# EasyEDA Pro project tachyon.eprj, schematic io-board-schematic

## Sheets
1 IO: Board Name: io-board; Create Date: 2026-04-07; Page Name: IO; Project Name: tachyon; Schematic Name: tachyon-board-schematic; Update Date: 2026-04-30; Company: EasyEDA.com; Page Size: A4; Version: V1.0
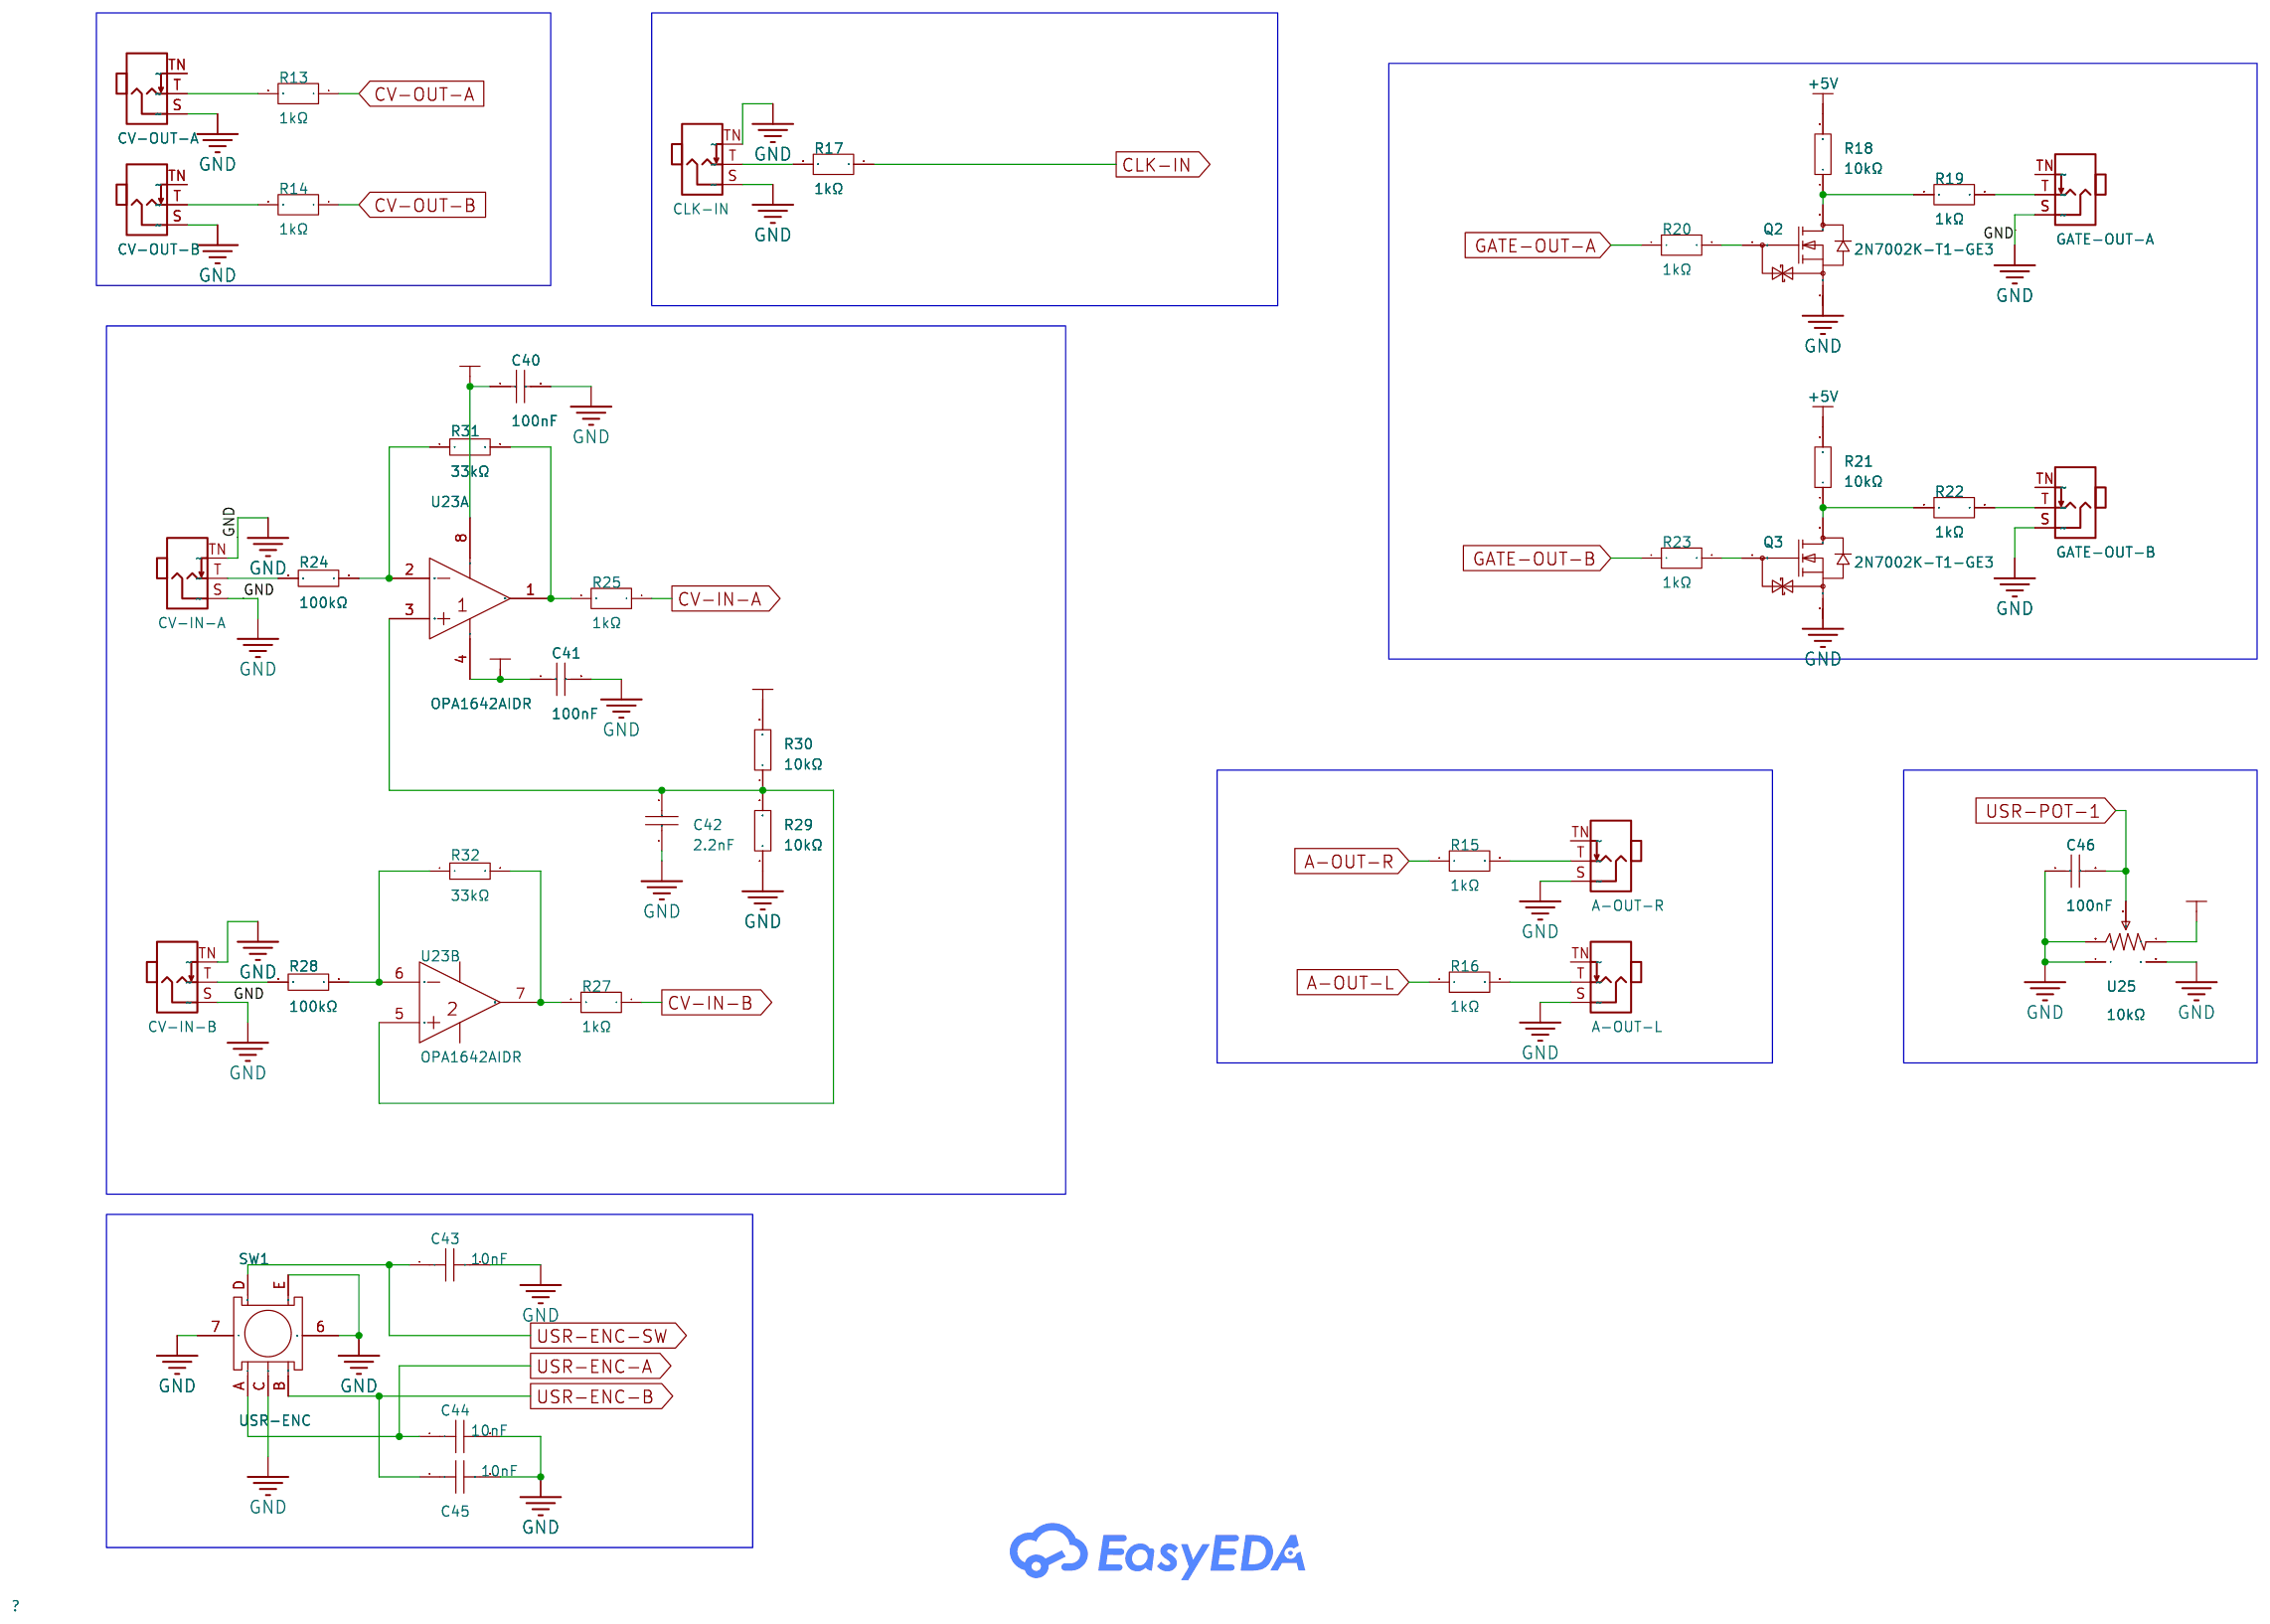
[diagram p0: IO]
2 Interconnect: Create Date: 2026-04-23; Page Name: Interconnect; Schematic Name: tachyon; Update Date: 2026-04-23
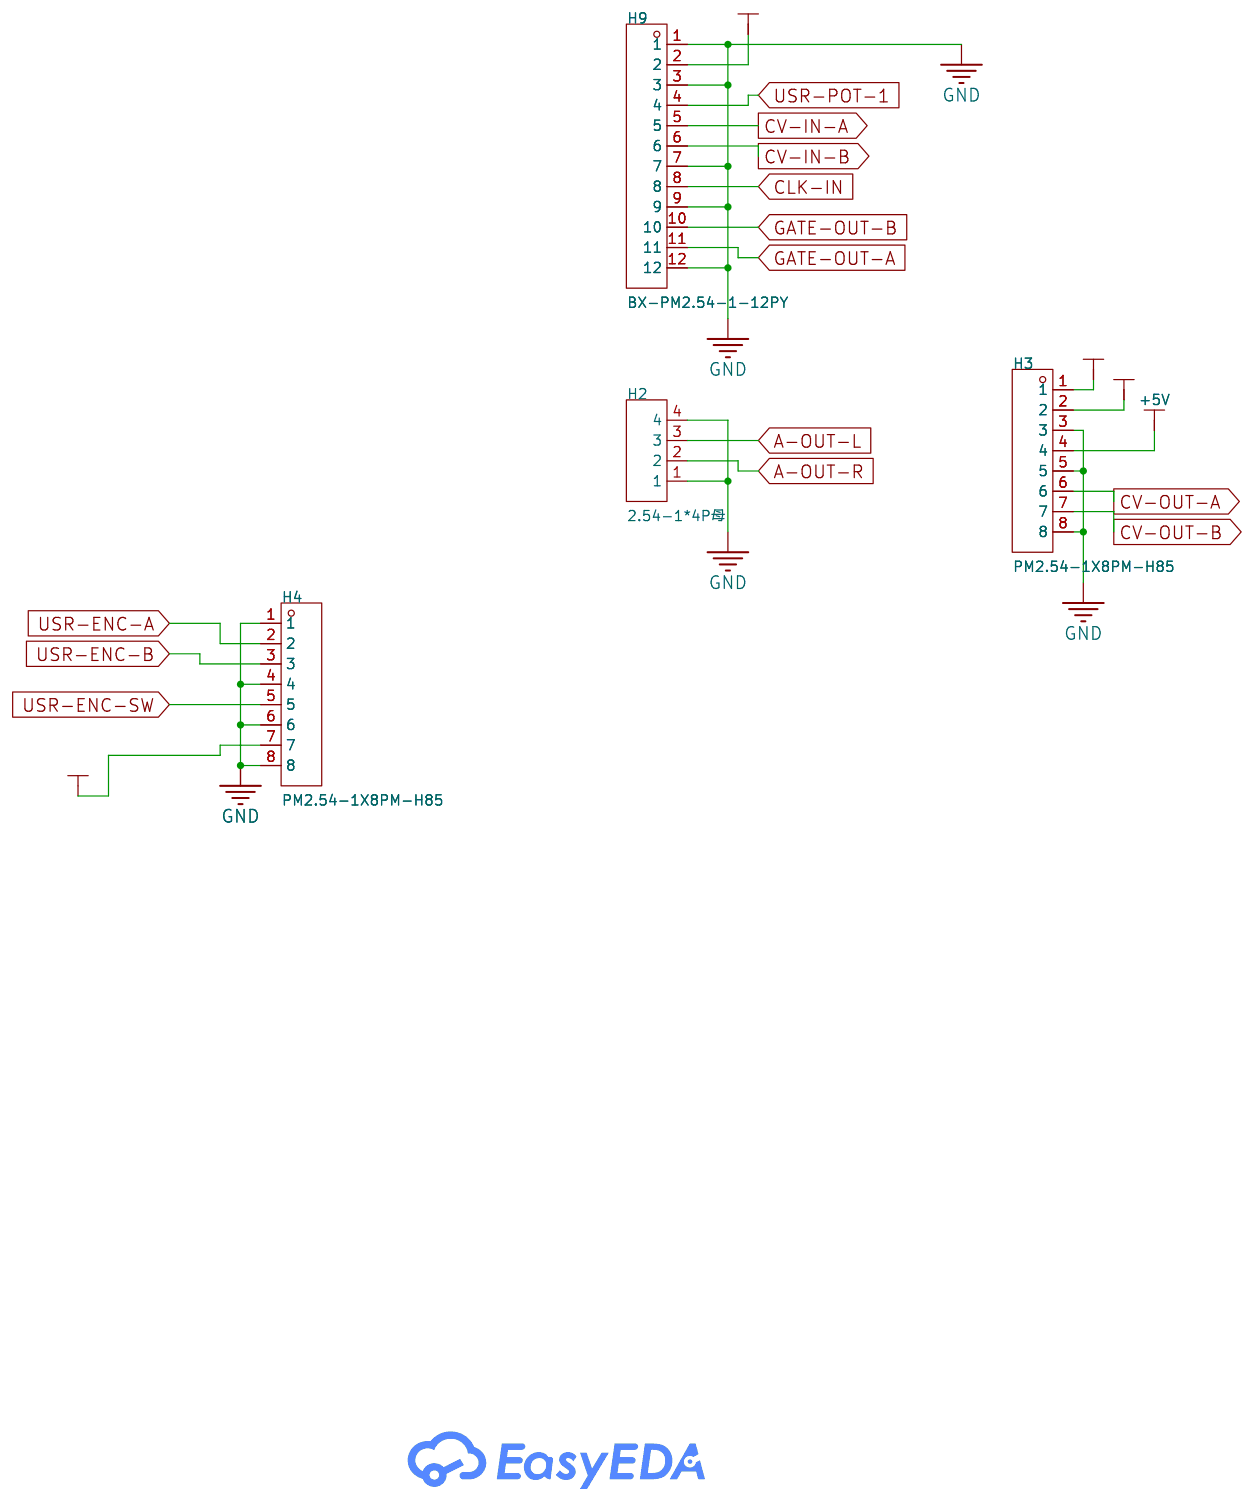
[diagram p1: Interconnect]

## Parts
sheet Interconnect
H2  2.54-1*4P母  [HDR-TH_4P-P2.54-V-F]
H3  PM2.54-1X8PM-H85  [HDR-TH_8P-P2.54-V-F]
H4  PM2.54-1X8PM-H85  [HDR-TH_8P-P2.54-V-F]
H9  BX-PM2.54-1-12PY  [HDR-TH_12P-P2.54-V-F]
sheet IO
C40  100nF  [C0805]
C41  100nF  [C0805]
C42  2.2nF  [C0805]
C43  10nF  [C0805]
C44  10nF  [C0805]
C45  10nF  [C0805]
C46  100nF  [C0805]
Q2  2N7002K-T1-GE3  [SOT-23-3_L2.9-W1.6-P1.90-LS2.8-BR]
Q3  2N7002K-T1-GE3  [SOT-23-3_L2.9-W1.6-P1.90-LS2.8-BR]
R13  1kΩ  [R0805]
R14  1kΩ  [R0805]
R15  1kΩ  [R0805]
R16  1kΩ  [R0805]
R17  1kΩ  [R0805]
R18  10kΩ  [R0805]
R19  1kΩ  [R0805]
R20  1kΩ  [R0805]
R21  10kΩ  [R0805]
R22  1kΩ  [R0805]
R23  1kΩ  [R0805]
R24  100kΩ  [R0805]
R25  1kΩ  [R0805]
R27  1kΩ  [R0805]
R28  100kΩ  [R0805]
R29  10kΩ  [R0805]
R30  10kΩ  [R0805]
R31  33kΩ  [R0805]
R32  33kΩ  [R0805]
SW1  USR-ENC  [SW-TH_EC11XXXXXXXX]
U8  CV-OUT-A  [Jack_3.5mm_QingPu_WQP-PJ301M-12_Vertical]
U9  CV-OUT-B  [Jack_3.5mm_QingPu_WQP-PJ301M-12_Vertical]
U17  A-OUT-R  [Jack_3.5mm_QingPu_WQP-PJ301M-12_Vertical]
U18  A-OUT-L  [Jack_3.5mm_QingPu_WQP-PJ301M-12_Vertical]
U19  CLK-IN  [Jack_3.5mm_QingPu_WQP-PJ301M-12_Vertical]
U20  GATE-OUT-A  [Jack_3.5mm_QingPu_WQP-PJ301M-12_Vertical]
U21  GATE-OUT-B  [Jack_3.5mm_QingPu_WQP-PJ301M-12_Vertical]
U22  CV-IN-A  [Jack_3.5mm_QingPu_WQP-PJ301M-12_Vertical]
U23  OPA1642AIDR  [SOIC-8_L4.9-W3.9-P1.27-LS6.0-BL]  (sections 1,2)
U24  CV-IN-B  [Jack_3.5mm_QingPu_WQP-PJ301M-12_Vertical]
U25  10kΩ  [RES-ADJ-TH_RK09L1140A65]

## Library data of the parts
H2 = 2.54-1*4P母: LCSC Part Name: 间距:2.54mm 1x4P 直插; Supplier Part: C2718488; Manufacturer: BOOMELE(博穆精密); Supplier Footprint: 插件,P=2.54mm; JLCPCB Part Class: Extended Part; Datasheet: https://item.szlcsc.com/datasheet/2.54-1*4P%25E6%25AF%258D/2834502.html; Supplier: LCSC; Holes Structure: 1x4P; Pitch: 2.54mm; Circular Hole / Square Hole: Square Hole; Mounting Type: Through Hole; Number of Rows: 1; Number of Positions: 4P; Current Rating: 3A; Holes Direction: Top; Contact Material: Bronze; Operating Temperature: -40℃~+105℃
H3 H4 = PM2.54-1X8PM-H85: LCSC Part Name: 1x8P 间距:2.54mm 直插; Supplier Part: C42431840; Manufacturer: JXTCONN(聚兴泰); Supplier Footprint: 插件,P=2.54mm; JLCPCB Part Class: Extended Part; Datasheet: https://item.szlcsc.com/datasheet/PM2.54-1X8PM-H85/44458970.html; Supplier: LCSC; Holes Structure: 1x8P; Pitch: 2.54mm; Circular Hole / Square Hole: Square Hole; Mounting Type: Through Hole; Number of Rows: 1; Number of Positions: 8P; Current Rating: 3A; Holes Direction: Top; Insulation Height: 8.5mm; Contact Plating: Gold; Operating Temperature: -40℃~+105℃
H9 = BX-PM2.54-1-12PY: LCSC Part Name: 1x12P 间距:2.54mm 直插; Supplier Part: C18078134; Manufacturer: Bossie(博锡); Supplier Footprint: 插件,P=2.54mm; JLCPCB Part Class: Extended Part; Datasheet: https://item.szlcsc.com/datasheet/BX-PM2.54-1-12PY/19218535.html; Supplier: LCSC; Holes Structure: 1x12P; Pitch: 2.54mm; Circular Hole / Square Hole: Square Hole; Mounting Type: Through Hole; Number of Rows: 1; Number of Positions: 12P; Current Rating: 3A; Holes Direction: Top; Insulation Height: 8.5mm; Contact Material: Brass; Contact Plating: Gold; Operating Temperature: -40℃~+105℃; PIN Length: 3.2mm
C40 C41 C46 = CL21B104KBCNNNC: Capacitance:100nF Tolerance:±10% Tolerance:±10% Voltage Rating:50V Temperature Coefficient:X7R; LCSC Part Name: 100nF ±10% 50V; Supplier Part: C1711; Manufacturer: SAMSUNG(三星); Supplier Footprint: 0805; JLCPCB Part Class: Extended Part; Datasheet: https://item.szlcsc.com/datasheet/CL21B104KBCNNNC/2063.html; Supplier: LCSC; Tolerance: ±10%; Voltage Rating: 50V; Temperature Coefficient: X7R
C42 = CC0805JKNPO9BN222: LCSC Part Name: 2.2nF ±5% 50V; Supplier Part: C107103; Manufacturer: YAGEO(国巨); Supplier Footprint: 0805; JLCPCB Part Class: Extended Part; Datasheet: https://item.szlcsc.com/datasheet/CC0805JKNPO9BN222/108319.html; Supplier: LCSC; Tolerance: ±5%; Voltage Rating: 50V; Temperature Coefficient: NP0
C43-C45 = CC0805KRX7R9BB103: LCSC Part Name: 10nF ±10% 50V; Supplier Part: C83170; Manufacturer: YAGEO(国巨); Supplier Footprint: 0805; JLCPCB Part Class: Extended Part; Datasheet: https://item.szlcsc.com/datasheet/CC0805KRX7R9BB103/84334.html; Supplier: LCSC; Tolerance: ±10%; Voltage Rating: 50V; Temperature Coefficient: X7R
Q2 Q3 = 2N7002K-T1-GE3: LCSC Part Name: 1个N沟道 耐压:60V 电流:300mA; Supplier Part: C81445; Manufacturer: VISHAY(威世); Supplier Footprint: SOT-23; JLCPCB Part Class: Extended Part; Datasheet: https://item.szlcsc.com/datasheet/2N7002K-T1-GE3/82596.html; Supplier: LCSC; Number: One N-channel; Drain to Source Voltage: 60V; Current - Continuous Drain(Id): 300mA; RDS(on): 2Ω@10V,500mA; Pd - Power Dissipation: 350mW; Gate Threshold Voltage (Vgs(th)): 2.5V; Gate Charge(Qg): 600pC@10V; Reverse Transfer Capacitance (Crss@Vds): 2.5pF@10V; Operating Temperature: -55℃~+150℃
R13-R17 R19 R20 R22 R23 R25 R27 = AC0805FR-7W1KL: Type:Thick Film Resistors Resistance: Tolerance:±1% Tolerance:±1% Power(Watts):250mW Overload Voltage (Max): Temperature Coefficient:±100ppm/℃ Temperature Coefficient:±100ppm/℃ Operating Temperature Range:-55℃~+155℃ Operating Temperature Range:-55℃~+155℃; LCSC Part Name: 厚膜电阻 1kΩ ±1% 250mW; Supplier Part: C727989; Manufacturer: YAGEO(国巨); Supplier Footprint: 0805; JLCPCB Part Class: Extended Part; Datasheet: https://atta.szlcsc.com/upload/public/pdf/source/20200821/C727952_41DBFD40DC9019BCD03635260E40DDDE.pdf; Supplier: LCSC; Type: Thick Film Resistors; Tolerance: ±1%; Power(Watts): 250mW; Temperature Coefficient: ±100ppm/℃; Operating Temperature Range: -55℃~+155℃
R18 R21 R29 R30 = AC0805FR-0710KL: LCSC Part Name: 厚膜电阻 10kΩ ±1% 125mW; Supplier Part: C140868; Manufacturer: YAGEO(国巨); Supplier Footprint: 0805; JLCPCB Part Class: Extended Part; Datasheet: https://item.szlcsc.com/datasheet/AC0805FR-0710KL/152196.html; Supplier: LCSC; Type: Thick Film Resistor; Tolerance: ±1%; Power(Watts): 125mW; Voltage-Supply(Max): 150V; Temperature Coefficient: ±100ppm/℃; Operating Temperature: -55℃~+155℃
R24 R28 = AC0805FR-07100KL: LCSC Part Name: 厚膜电阻 100kΩ ±1% 125mW; Supplier Part: C144587; Manufacturer: YAGEO(国巨); Supplier Footprint: 0805; JLCPCB Part Class: Extended Part; Datasheet: https://atta.szlcsc.com/upload/public/pdf/source/20180927/C229861_4ABDC471507C1ED6AFB4BA66AFC8620A.pdf; Supplier: LCSC; Type: Thick Film Resistors; Tolerance: ±1%; Temperature Coefficient: ±100ppm/℃; Operating Temperature Range: -55℃~+155℃
R31 R32 = AC0805FR-0733KL: LCSC Part Name: 厚膜电阻 33kΩ ±1% 125mW; Supplier Part: C144563; Manufacturer: YAGEO(国巨); Supplier Footprint: 0805; JLCPCB Part Class: Extended Part; Datasheet: https://atta.szlcsc.com/upload/public/pdf/source/20180927/C229861_4ABDC471507C1ED6AFB4BA66AFC8620A.pdf; Supplier: LCSC; Type: Thick Film Resistors; Tolerance: ±1%; Temperature Coefficient: ±100ppm/℃; Operating Temperature Range: -55℃~+155℃
SW1 = EC11E18244AU: LCSC Part Name: 11mm尺寸金属轴型编码器; Supplier Part: C202365; Manufacturer: ALPSALPINE(阿尔卑斯阿尔派); Supplier Footprint: 插件; JLCPCB Part Class: Extended Part; Datasheet: https://item.szlcsc.com/datasheet/EC11E18244AU/203565.html; Supplier: LCSC
U8 U9 U17-U22 U24 = AudioJack2_SwitchT
U23 = OPA1642AIDR: Class:- Speaker Channels:2-Channel Output Power:- Total Harmonic Distortion + Noise (THD+N):0.00005% Quiescent Current:1.8mA Signal-to-Noise Ratio:- Power Supply Rejection Ratio (PSRR):- Efficiency:- Number of Inputs:2 Pairs Differential Inputs Features:-; LCSC Part Name: OPA164x 声加高性能、结型场效应晶体管输入音频运算放大器; Supplier Part: C67640; Manufacturer: TI(德州仪器); Supplier Footprint: SOIC-8; JLCPCB Part Class: Extended Part; Datasheet: https://www.ti.com/cn/lit/gpn/opa1642; Supplier: LCSC; Speaker Channels: 2-Channel; Total Harmonic Distortion + Noise (THD+N): 0.00005%; Quiescent Current: 1.8mA; Number of Inputs: 2 Pairs Differential Inputs; Voltage - Supply: 2.25V~18V；-18V~-2.25V; Operating Temperature: -40℃~+85℃
U25 = RK09L1140A2U: Resistance:10kΩ Tolerance:±20% Tolerance:±20% Voltage Rating:10V Power(Watts):50mW Number of Turns:-; LCSC Part Name: 三件套 10kΩ ±20%; Supplier Part: C470448; Manufacturer: ALPSALPINE(阿尔卑斯阿尔派); Supplier Footprint: 插件; JLCPCB Part Class: Extended Part; Datasheet: https://item.szlcsc.com/datasheet/RK09L1140A2U/476528.html; Supplier: LCSC; Tolerance: ±20%; Voltage Rating: 10V; Power(Watts): 50mW

## Nets
+3V3: H4.7 U25.1
+5V: H3.4 R18.2 R21.2
+12V: C40.1 H3.1 U23.8(V+)
-12V: C41.1 H3.2 U23.4(V-)
GND: C40.2 C41.2 C42.1 C43.2 C44.2 C45.2 C46.1 H2.1 H2.4 H3.3 H3.5 H3.8 H4.1 H4.4 H4.6 H4.8 H9.1 H9.3 H9.7 H9.9 H9.12 Q2.2(S) Q3.2(S) R29.1 SW1.6 SW1.7 SW1.C SW1.E U8.S U9.S U17.S U18.S U19.S U19.TN U20.S U21.S U22.S U22.TN U24.S U24.TN U25.3 U25.4 U25.5
A-OUT-L: H2.3 R16.1
A-OUT-R: H2.2 R15.1
CLK-IN: H9.8 R17.1
CV-IN-A: H9.5 R25.1
CV-IN-B: H9.6 R27.1
CV-OUT-A: H3.6 R13.1
CV-OUT-B: H3.7 R14.1
GATE-OUT-A: H9.11 R20.1
GATE-OUT-B: H9.10 R23.1
USR-ENC-A: C44.1 H4.2 SW1.A
USR-ENC-B: C45.1 H4.3 SW1.B
USR-ENC-SW: C43.1 H4.5 SW1.D
USR-POT-1: C46.2 H9.4 U25.2
VREF: H9.2 R30.2
$3N5741: R15.2 U17.T
$3N5746: R16.2 U18.T
$3N6968: R17.2 U19.T
$3N7465: Q2.3(D) R18.1 R19.1
$3N7646: R19.2 U20.T
$3N7687: Q2.1(G) R20.2
$3N7930: Q3.3(D) R21.1 R22.1
$3N7933: Q3.1(G) R23.2
$3N7937: R22.2 U21.T
$3N9421: R24.2 U22.T
$3N9619: R24.1 R31.1 U23.2(INA-)
$3N9658: R25.2 R31.2 U23.1(OUTA)
$3N11411: R28.2 U24.T
$3N11416: R28.1 R32.1 U23.6(INB-)
$3N11459: C42.2 R29.2 R30.1 U23.3(INA+) U23.5(INB+)
$3N12731: R27.2 R32.2 U23.7(OUTB)
Net-(R13-2): R13.2 U8.T
Net-(R14-2): R14.2 U9.T

Not connected (* = marked no-connect by the designer): U8 TN; U9 TN; U17 TN; U18 TN; U20 TN; U21 TN
